# EAGLE design Skull Candy Lamp (EAGLE 9.6.2)

## Sheet 1 of 2: ESP32 Pico
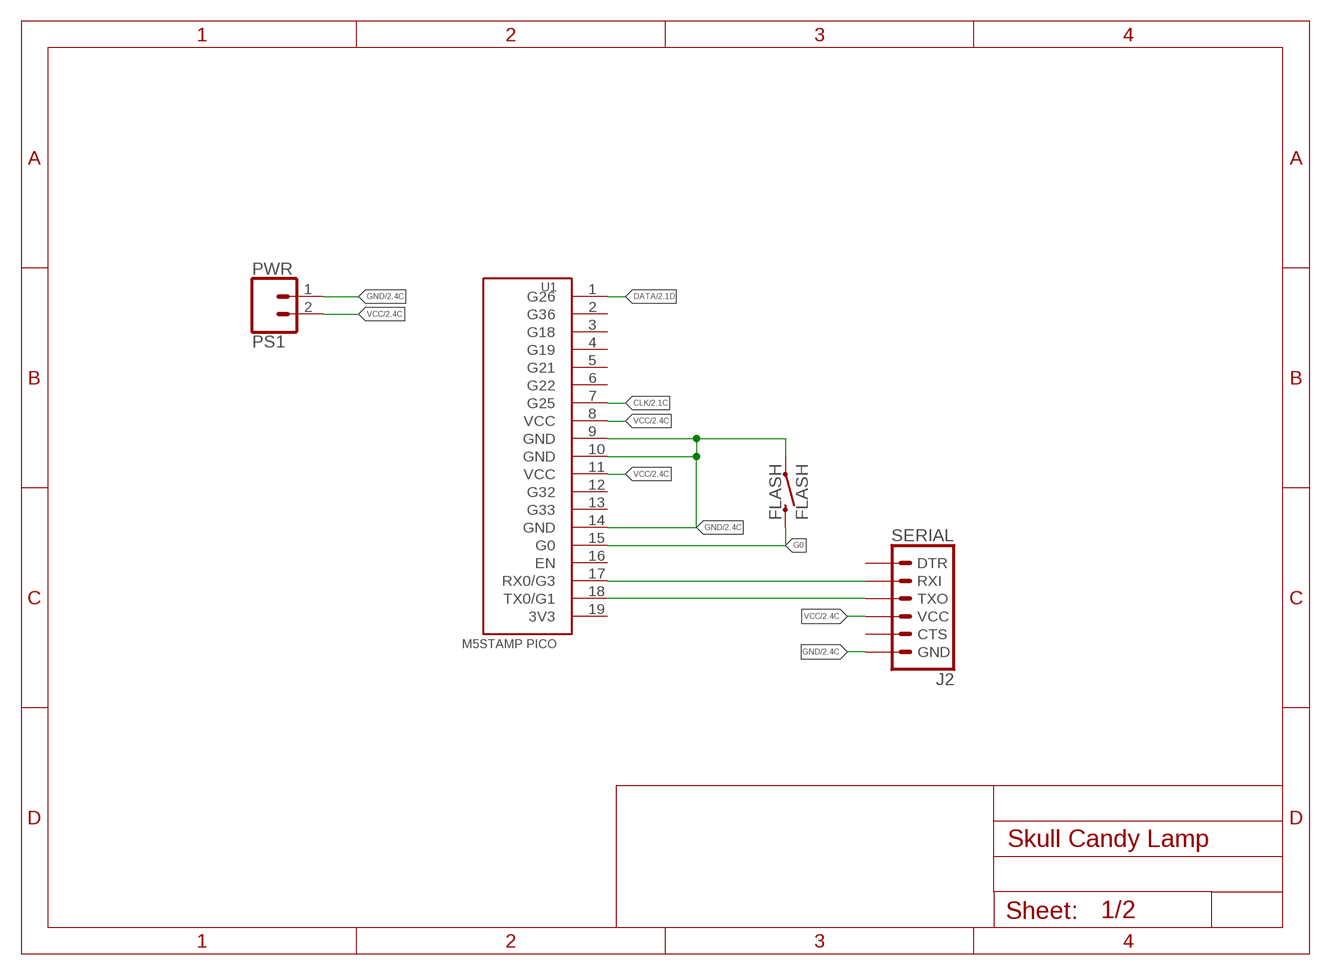
[diagram p0: schematic, sheet 1]

### Parts
FLASH  FLASH  MOMENTARY-SWITCH-SPST-SMD-5.2MM  [TACTILE_SWITCH_SMD_5.2MM]
J2  SERIAL  6_PIN_SERIAL_TARGETSILK  [6_PIN_SERIAL_TARGET_SIDE_W_SILK]
PS1  PWR  CONN_02POLAR_LOCK  [MOLEX-1X2_LOCK]
U1  M5STAMP PICO  M5STAMP-PICO  [M5STAMP-PICO]

### Nets
CLK: U1.7(G25) ; also sheet 2
DATA: U1.1(G26) ; also sheet 2
G0: FLASH.3 U1.15(G0)
GND: FLASH.1 J2.P$6(GND) PS1.1 U1.9(GND) U1.10(GND) U1.14(GND) ; also sheet 2
RX: J2.P$3(RXI) U1.17(RX0/G3)
TX: J2.P$2(TXO) U1.18(TX0/G1)
VCC: J2.P$4(VCC) PS1.2 U1.8(VCC) U1.11(VCC) ; also sheet 2
Unconnected: J2.P$1(DTR) J2.P$5(CTS) U1.2(G36) U1.3(G18) U1.4(G19) U1.5(G21) U1.6(G22) U1.12(G32) U1.13(G33) U1.16(EN)

## Sheet 2 of 2: LED Array
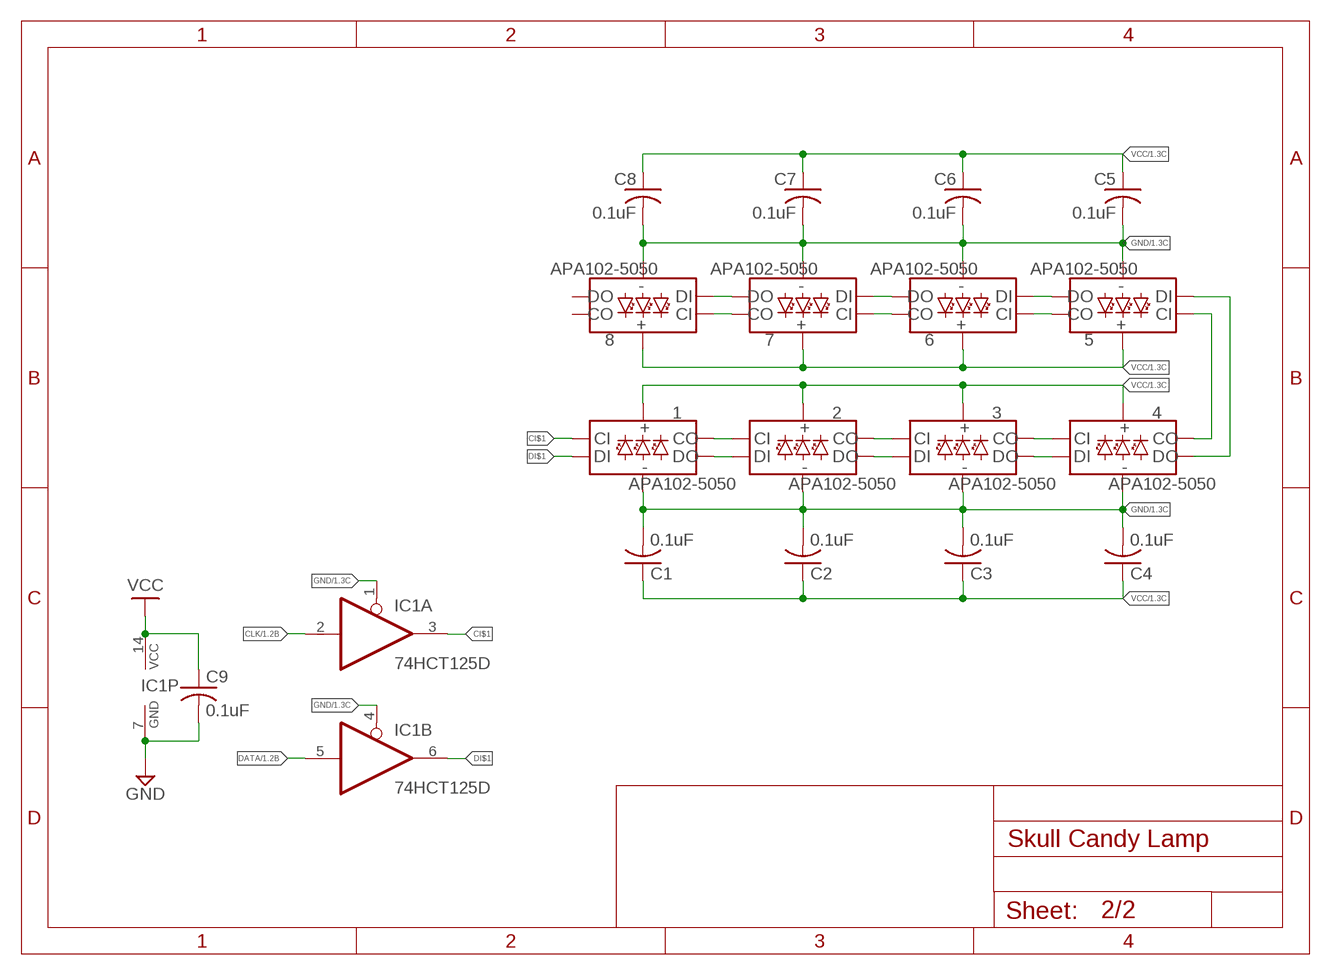
[diagram p1: schematic, sheet 2]

### Parts
1  APA102-5050  [APA102-5050]
2  APA102-5050  [APA102-5050]
3  APA102-5050  [APA102-5050]
4  APA102-5050  [APA102-5050]
5  APA102-5050  [APA102-5050]
6  APA102-5050  [APA102-5050]
7  APA102-5050  [APA102-5050]
8  APA102-5050  [APA102-5050]
C1  0.1uF  C-US_CHIP-0805(2012-METRIC)  [CAPC2012X110]
C2  0.1uF  C-US_CHIP-0805(2012-METRIC)  [CAPC2012X110]
C3  0.1uF  C-US_CHIP-0805(2012-METRIC)  [CAPC2012X110]
C4  0.1uF  C-US_CHIP-0805(2012-METRIC)  [CAPC2012X110]
C5  0.1uF  C-US_CHIP-0805(2012-METRIC)  [CAPC2012X110]
C6  0.1uF  C-US_CHIP-0805(2012-METRIC)  [CAPC2012X110]
C7  0.1uF  C-US_CHIP-0805(2012-METRIC)  [CAPC2012X110]
C8  0.1uF  C-US_CHIP-0805(2012-METRIC)  [CAPC2012X110]
C9  0.1uF  C-US_CHIP-0805(2012-METRIC)  [CAPC2012X110]
IC1  74HCT125D  [SO14]

### Nets
CI$1: 1.P2(CI) IC1.3(A:O)
CI$2: 1.P5(CO) 2.P2(CI)
CI$3: 2.P5(CO) 3.P2(CI)
CI$4: 3.P5(CO) 4.P2(CI)
CI$5: 4.P5(CO) 5.P2(CI)
CI$6: 5.P5(CO) 6.P2(CI)
CI$7: 6.P5(CO) 7.P2(CI)
CI$8: 7.P5(CO) 8.P2(CI)
CLK: IC1.2(A:I) ; also sheet 1
DATA: IC1.5(B:I) ; also sheet 1
DI$1: 1.P1(DI) IC1.6(B:O)
DI$2: 1.P6(DO) 2.P1(DI)
DI$3: 2.P6(DO) 3.P1(DI)
DI$4: 3.P6(DO) 4.P1(DI)
DI$5: 4.P6(DO) 5.P1(DI)
DI$6: 5.P6(DO) 6.P1(DI)
DI$7: 6.P6(DO) 7.P1(DI)
DI$8: 7.P6(DO) 8.P1(DI)
GND: 1.P3(GND) 2.P3(GND) 3.P3(GND) 4.P3(GND) 5.P3(GND) 6.P3(GND) 7.P3(GND) 8.P3(GND) C1.2 C2.2 C3.2 C4.2 C5.2 C6.2 C7.2 C8.2 C9.2 IC1.1(A:OE) IC1.4(B:OE) IC1.7(P:GND) ; also sheet 1
VCC: 1.P4(VCC) 2.P4(VCC) 3.P4(VCC) 4.P4(VCC) 5.P4(VCC) 6.P4(VCC) 7.P4(VCC) 8.P4(VCC) C1.1 C2.1 C3.1 C4.1 C5.1 C6.1 C7.1 C8.1 C9.1 IC1.14(P:VCC) ; also sheet 1
Unconnected: 8.P5(CO) 8.P6(DO) IC1.8(C:O) IC1.9(C:I) IC1.10(C:OE) IC1.11(D:O) IC1.12(D:I) IC1.13(D:OE)

## Power pins joined to a net without a drawn wire
3V3: U1.19(3V3)

## Library data of the parts
1-8 = SparkFun-LED:APA102: Addressable RGB LED - 2 Wire Common names: APA102, Dotstar, etc. Packages: 5050 2020 SparkFun Products: SparkFun Lumenati Boards <https://www.sparkfun.com/categories/405>; PROD_ID: DIO-13739
C1-C9 = Capacitor:C-US: Capacitor - ANSI; CATEGORY: Capacitor
FLASH = SparkFun-Switches:MOMENTARY-SWITCH-SPST: Momentary Switch (Pushbutton) - SPST Normally-open (NO) SPST momentary switches (buttons, pushbuttons). Variants PTH-12MM - 12mm square, through-hole Momentary Pushbutton Switch - 12mm Square <https://www.sparkfun.com/products/9190> (COM-09190) PTH-6.0MM, PTH-6.0MM-KIT - 6.0mm square, through-hole Mini Pushbutton Switch <https://www.sparkfun.com/products/97> (COM-00097) KIT package intended for soldering kit's - only one side of pads' copper is exposed. PTH-RIGHT-ANGLE-KIT - Right-angle, through-hole Right Angle Tactile Button <https://www.sparkfun.com/products/10791> - Used on SparkFun BigTime Watch Kit <https://www.sparkfun.com/products/11734> SMD-12MM - 12mm square, surface-mount Tactile Button - SMD (12mm) <https://www.sparkfun.com/products/12993> (COM-12993) Used on SparkFun PicoBoard <https://www.sparkfun.com/products/11888> SMD-4.5MM - 4.5mm Square Trackball Switch Used on SparkFun Blackberry Trackballer Breakout <https://www.sparkfun.com/products/13169> SMD-4.6MMX2.8MM - 4.60mm x 2.80mm, surface mount Used on SparkFun SAMD21 Mini Breakout <https://www.sparkfun.com/products/13664> SMD-5.2MM, SMD-5.2-REDUNDANT - 5.2mm square, surface-mount Mini Pushbutton Switch - SMD <https://www.sparkfun.com/products/8720> (COM-08720) Used on Arduino Pro Mini <https://www.sparkfun.com/products/11114> REDUNDANT package connects both switch circuits together SMD-6.0X3.5MM - 6.0 x 3.5mm, surface mount Momentary Reset Switch SMD <https://www.sparkfun.com/products/8229> (COM-08229) SMD-6.2MM-TALL - 6.2mm square, surface mount Tactile Button - SMD (6mm) <https://www.sparkfun.com/products/12992> Used on SparkFun Digital Sandbox <https://www.sparkfun.com/products/12651> SMD-RIGHT-ANGLE - Right-angle, surface mount Used on SparkFun Block for Intel® Edison - Arduino <https://www.sparkfun.com/products/13036>; PROD_ID: SWCH-08247; SF_SKU: COM-08720
IC1 = 74xx-eu:74*125: Quad bus BUFFER, 3-state
J2 = SparkFun-Connectors:6_PIN_SERIAL_TARGET: 6-pin header connection for use with the "FTDI BASIC" pinout - TARGET SIDE. Also known as "Arduino Serial Program Header". It is used to mate with our FTDI Basic serial programmers using the Arduino IDE. Note, this device has "TARGET" in the name. It is intended to be used on a design that contains a target micro-controller that you wish to program. The "sister" device, named "CABLE" is inteneded to be used on a design that usually lives on the end of your USB cable and prvides the converter chip (FTDI232 or FTDI231x) to commnicate serial RX/TX. You can populate with some of these: Break Away Headers - Straight <https://www.sparkfun.com/products/116> (PRT-00116) For reference (or to suit your programming needs) check out these designs: SparkFun FTDI Basic Breakout - 5V <https://www.sparkfun.com/products/9716> (DEV-09716) SparkFun FTDI Basic Breakout - 3.3V <https://www.sparkfun.com/products/9873> (DEV-09873) SparkFun FTDI SmartBasic <https://www.sparkfun.com/products/12935> (DEV-12935) SparkFun Beefy 3 - FTDI Basic Breakout <https://www.sparkfun.com/products/13746> (DEV-13746)
PS1 = SparkFun-Connectors:CONN_02: Multi connection point. Often used as Generic Header-pin footprint for 0.1 inch spaced/style header connections On any of the 0.1 inch spaced packages, you can populate with these: Break Away Headers - Straight <https://www.sparkfun.com/products/116> (PRT-00116) Break Away Male Headers - Right Angle <https://www.sparkfun.com/products/553> (PRT-00553) Female Headers <https://www.sparkfun.com/products/115> (PRT-00115) Break Away Headers - Machine Pin <https://www.sparkfun.com/products/117> (PRT-00117) Break Away Female Headers - Swiss Machine Pin <https://www.sparkfun.com/products/743> (PRT-00743) For SCREWTERMINALS and SPRING TERMINALS visit here: Screw Terimnals on SparkFun.com <https://www.sparkfun.com/search/results?term=Screw+Terminals> (5mm/3.5mm/2.54mm spacing) This device is also useful as a general connection point to wire up your design to another part of your project. Our various solder wires solder well into these plated through hole pads. Hook-Up Wire - Assortment (Stranded, 22 AWG) <https://www.sparkfun.com/products/11375> (PRT-11375) Hook-Up Wire - Assortment (Solid Core, 22 AWG) <https://www.sparkfun.com/products/11367> (PRT-11367) View the entire wire category on our website here <https://www.sparkfun.com/categories/141> Special notes: Molex polarized connector foot print use with: PRT-08233 with associated crimp pins and housings. 2.54_SCREWTERM for use with PRT-10571. 3.5mm Screw Terminal footprints for PRT-08084 5mm Screw Terminal footprints for use with PRT-08432; SF_ID: PRT-09918
U1 = custom:M5STAMP-PICO: M5 Stamp Pico <https://docs.m5stack.com/en/core/stamp_pico>

## Board
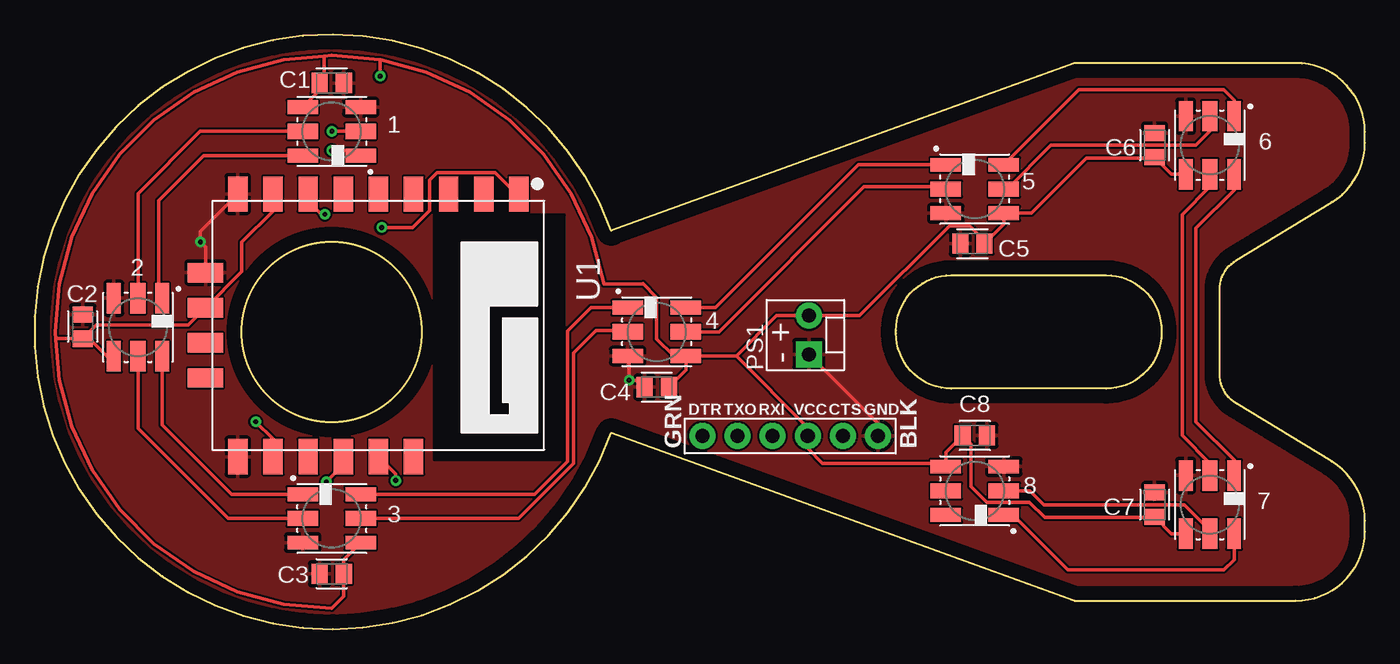
[diagram p2: board, top side]
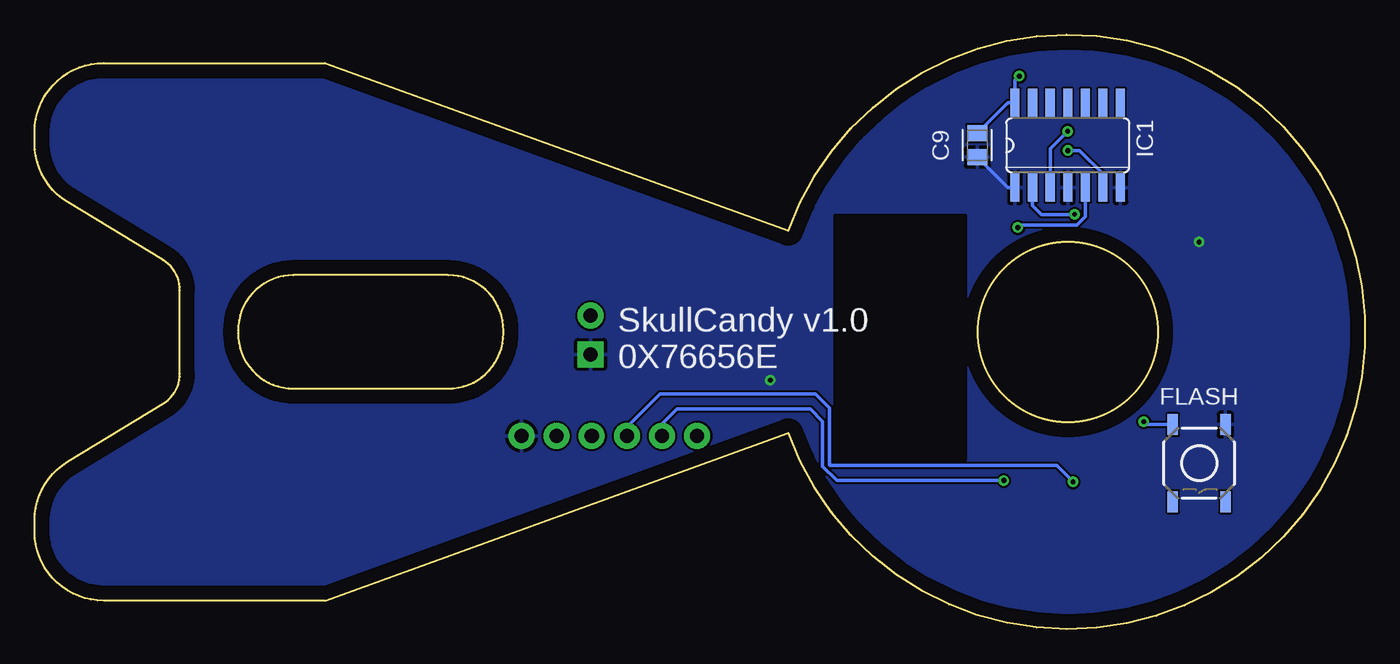
[diagram p3: board, bottom side, seen from below]

Size 96.2 x 43.01 mm. Coordinates in mm from the lower left corner, seen from the top.
Outline: 93.8,12.12 86.91,16.31 arc-59 85.69,18.48 85.69,24.53 arc-59 86.91,26.7 93.8,30.89 arc59 96.2,35.16 96.2,35.96 arc90 91.2,40.96 75.2,40.96 41.7,28.83 arc320 41.7,14.19 75.2,2.06 91.2,2.06 arc90 96.2,7.06 96.2,7.85 arc59 93.8,12.12
Outline: 81.49,21.61 81.49,21.41 arc-90 77.49,17.41 66.29,17.41 arc-90 62.29,21.41 62.29,21.61 arc-90 66.29,25.61 77.49,25.61 arc-90 81.49,21.61
Outline: circle at 21.49,21.51 radius 6.5
Copper layers (1*16): Top 0.035mm / dielectric 1.5mm / Bottom 0.035mm
Design rules "default *": minimum track width 6mil, minimum drill 0.35mm, track to track 6mil, track to pad 6mil, pad to pad 6mil, via to via 6mil, smd to smd 6mil, copper to edge 40mil, drill to drill 6mil, minimum pad ring 10mil, minimum via ring 8mil, stop-mask expansion 4mil, vias tented up to drill 20mm, thermal gap 10mil

### Footprints (pad centres in the part's own frame; a part is rotated, then mirrored left to right if it is on the bottom)
APA102-5050 = smd 1 x 2.2: P1 -1.75,-2.1; P3 1.75,-2.1; P4 1.75,2.1; P6 -1.75,2.1 | smd 1.1 x 2.2: P2 0,-2.1; P5 0,2.1
CAPC2012X110 = smd 1.165 x 1.465: 1 -0.875,0; 2 0.875,0
TACTILE_SWITCH_SMD_5.2MM = smd 1.524 x 0.762: 1 -2.794,1.905; 2 2.794,1.905; 3 -2.794,-1.905; 4 2.794,-1.905
SO14 = smd 0.66 x 2.032: 1 -3.81,-3.073; 2 -2.54,-3.073; 3 -1.27,-3.073; 4 0,-3.073; 5 1.27,-3.073; 6 2.54,-3.073; 7 3.81,-3.073; 8 3.81,3.073; 9 2.54,3.073; 10 1.27,3.073; 11 0,3.073; 12 -1.27,3.073; 13 -2.54,3.073; 14 -3.81,3.073
6_PIN_SERIAL_TARGET_SIDE_W_SILK = drill 1.016 pad 1.88: P$1 -6.35,0; P$2 -3.81,0; P$3 -1.27,0; P$4 1.27,0; P$5 3.81,0; P$6 6.35,0
MOLEX-1X2_LOCK = drill 1.016 pad 1.88 square: 1 -0.127,0 | drill 1.016 pad 1.88: 2 2.667,0
M5STAMP-PICO = smd 2.54 x 1.4: 1 -9.5,10.16; 2 -9.5,7.62; 3 -9.5,5.08; 4 -9.5,2.54; 5 -9.5,0; 6 -9.5,-2.54; 7 -9.5,-5.08; 8 -9.5,-7.62; 9 -9.5,-10.16; 14 9.5,-10.16; 15 9.5,-7.62; 16 9.5,-5.08; 17 9.5,-2.54; 18 9.5,0; 19 9.5,2.54 | smd 1.4 x 2.54: 10 -3.81,-12.5; 11 -1.27,-12.5; 12 1.27,-12.5; 13 3.81,-12.5

### Placement (x,y rotation side)
1  21.49,36.01 90 top
2  7.48,21.84 180 top
3  21.49,8.01 270 top
4  44.99,21.51 270 top
5  67.99,31.84 270 top
6  84.99,35.01 180 top
7  84.99,9.01 180 top
8  67.99,10.01 90 top
C1  21.49,39.51 0 top
C2  3.48,21.89 90 top
C3  21.49,4.01 180 top
C4  44.99,17.51 180 top
C5  67.81,27.89 180 top
C6  80.99,35.01 90 top
C7  80.99,9.01 90 top
C8  67.99,14.01 0 top
C9  28.03,35.01 270 bottom
FLASH  11.99,12.01 270 bottom
IC1  21.49,35.01 0 bottom
J2  54.64,13.97 0 top
PS1  55.99,20.01 90 top
U1  24.86,21.98 270 top

### Tracks (layer width: path | path; a pad name or v marks a point on that pad's centre or on a via)
CI$1  (via drill 0.35)
  Top 0.254: v21.5,36.02 23.57,36.02 1.P2
  Bottom 0.254: IC1.3 22.76,34.76 v21.5,36.02
CI$2
  Top 0.254: 1.P5 11.99,36.01 7.48,31.5 2.P2
CI$3
  Top 0.254: 2.P5 7.48,14.52 13.99,8.01 3.P2
CI$4
  Top 0.254: 3.P5 34.98,8.01 38.96,11.98 38.96,19.97 40.58,21.6 42.79,21.6 4.P2
CI$5
  Top 0.254: 4.P5 49.49,21.51 59.99,32.01 65.72,32.01 5.P2
CI$6
  Top 0.254: 5.P5 70.33,31.84 73.5,35.01 83.99,35.01 84.99,36.01 6.P2
CI$7
  Top 0.254: 6.P5 84.99,32.01 82.99,30.01 82.99,14.01 84.99,12.01 7.P2
CI$8
  Top 0.254: 7.P5 84.99,7.15 83.13,9.01 72.99,9.01 71.99,10.01 8.P2
CLK  (via drill 0.35)
  Top 0.254: U1.7 19.78,30.97 20.74,30.01 v20.99,30.01
  Bottom 0.254: IC1.2 24.03,30.65 23.38,30.01 v20.99,30.01
DATA  (via drill 0.35)
  Top 0.254: U1.1 34.84,31.48 33.29,33.02 29.12,33.02 28.58,32.48 28.58,30.29 27.34,29.05 v25.1,29.05
  Bottom 0.254: IC1.5 20.22,29.85 20.84,29.22 24.93,29.22 v25.1,29.05
DI$1  (via drill 0.35)
  Top 0.254: v21.48,34.62 23.22,34.62 1.P1
  Bottom 0.254: IC1.6 18.95,32.94 20.64,34.62 v21.48,34.62
DI$2
  Top 0.254: 1.P6 12.24,34.26 8.99,31.01 8.99,24.18 2.P1
DI$3
  Top 0.254: 2.P6 9.23,14.77 14.24,9.76 3.P1
DI$4
  Top 0.254: 3.P6 36.16,9.76 38.55,12.15 38.55,21.57 40.24,23.26 4.P1
DI$5
  Top 0.254: 4.P6 49.24,23.26 59.57,33.59 5.P1
DI$6
  Top 0.254: 5.P6 75.51,39.01 85.99,39.01 86.74,38.26 6.P1
DI$7
  Top 0.254: 6.P6 86.74,31.76 83.99,29.01 83.99,15.01 86.74,12.26 7.P1
DI$8
  Top 0.254: 7.P6 86.74,5.02 85.99,4.27 74.72,4.27 70.74,8.26 8.P1
G0  (via drill 0.35)
  Top 0.254: U1.15 17.24,13.76 v15.99,15.01
  Bottom 0.254: v15.99,15.01 15.78,14.8 FLASH.3
GND  (via drill 0.35)
  Top 0.254: U1.10 12.36,27.64 v11.99,28.01 11.99,28.77 U1.9 | 4.P3 42.99,19.66 v42.99,18.01 43.61,18.01 C4.2 | J2.P$6 60.99,14.88 PS1.1
  Bottom 0.254: C9.2 25.83,31.93 IC1.1
  pour Top: -0.01,0.01 -0.01,43.01 96.2,43.01 96.2,0.01
  pour Bottom: -0.01,0.01 -0.01,43.01 96.2,43.01 96.2,0.01
RX  (via drill 0.35)
  Top 0.254: v21.1,10.66 22.32,11.88 U1.17
  Bottom 0.254: v21.1,10.66 22.27,11.83 38.68,11.83 38.73,11.89 38.73,16.01 39.73,17.01 50.99,17.01 53.37,14.63 J2.P$3
TX  (via drill 0.35)
  Top 0.254: U1.18 26.12,11.22 v26.12,10.75
  Bottom 0.254: v26.12,10.75 38.17,10.75 39.21,11.79 39.21,15.03 40.1,15.92 49.74,15.92 50.83,14.83 J2.P$2
VCC  (via drill 0.35)
  Top 0.254: 3.P4 22.36,5.03 C3.1 22.36,2.38 21.49,1.51 18.02,1.81 14.65,2.72 11.49,4.19 8.63,6.19 6.17,8.65 4.17,11.51 2.7,14.67 1.79,18.04 1.54,20.97 | C7.1 81.05,8.07 | 81.05,8.07 82.21,6.91 7.P4 | C6.1 81.05,34.07 | 81.05,34.07 82.21,32.91 6.P4 | 81.05,8.07 73.05,8.07 71.94,9.18 68.87,9.18 67.71,10.34 67.71,13.41 C8.1 65.89,12.78 8.P4 65.64,12.01 56.99,12.01 55.91,13.09 J2.P$4 55.81,14.06 55.81,14.68 50.74,19.76 | 81.05,34.07 76.05,34.07 72.07,30.09 5.P4 70.09,29.29 C5.1 68.68,28.11 67.63,29.16 66.14,29.16 59.66,22.67 PS1.2 53.66,22.67 50.74,19.76 | U1.8 17.24,30.26 14.99,28.01 14.99,25.88 U1.11 11.12,22.01 4.47,22.01 C2.1 | 25.04,41.18 28.33,40.3 31.49,38.83 34.35,36.83 36.81,34.37 38.81,31.51 40.28,28.35 41.19,24.98 43.96,24.98 43.99,25.01 44.99,24.01 44.99,21.01 46.24,19.76 4.P4 | 25.04,41.18 24.96,41.21 21.49,41.51 20.95,41.46 | 20.95,41.46 18.02,41.21 14.65,40.3 11.49,38.83 8.63,36.83 6.17,34.37 4.17,31.51 2.7,28.35 1.79,24.98 1.49,21.51 1.54,20.97 | 1.P4 20.61,38.98 C1.1 20.95,39.84 20.95,41.46 | v24.99,40.01 24.99,41.14 25.04,41.18 | 2.P4 5.26,19.74 3.99,21.01 3.74,20.75 C2.1 | C2.1 1.58,21.01 1.54,20.97 | C4.1 47.09,18.73 4.P4 | 50.74,19.76 4.P4
  Bottom 0.254: C9.1 25.83,38.08 IC1.14 25.3,39.7 v24.99,40.01

### Text on the board
bPlace: SkullCandy v1.0 / 0X76656E
tNames: - +